# EAGLE design test2.3schematic (EAGLE 9.6.2)
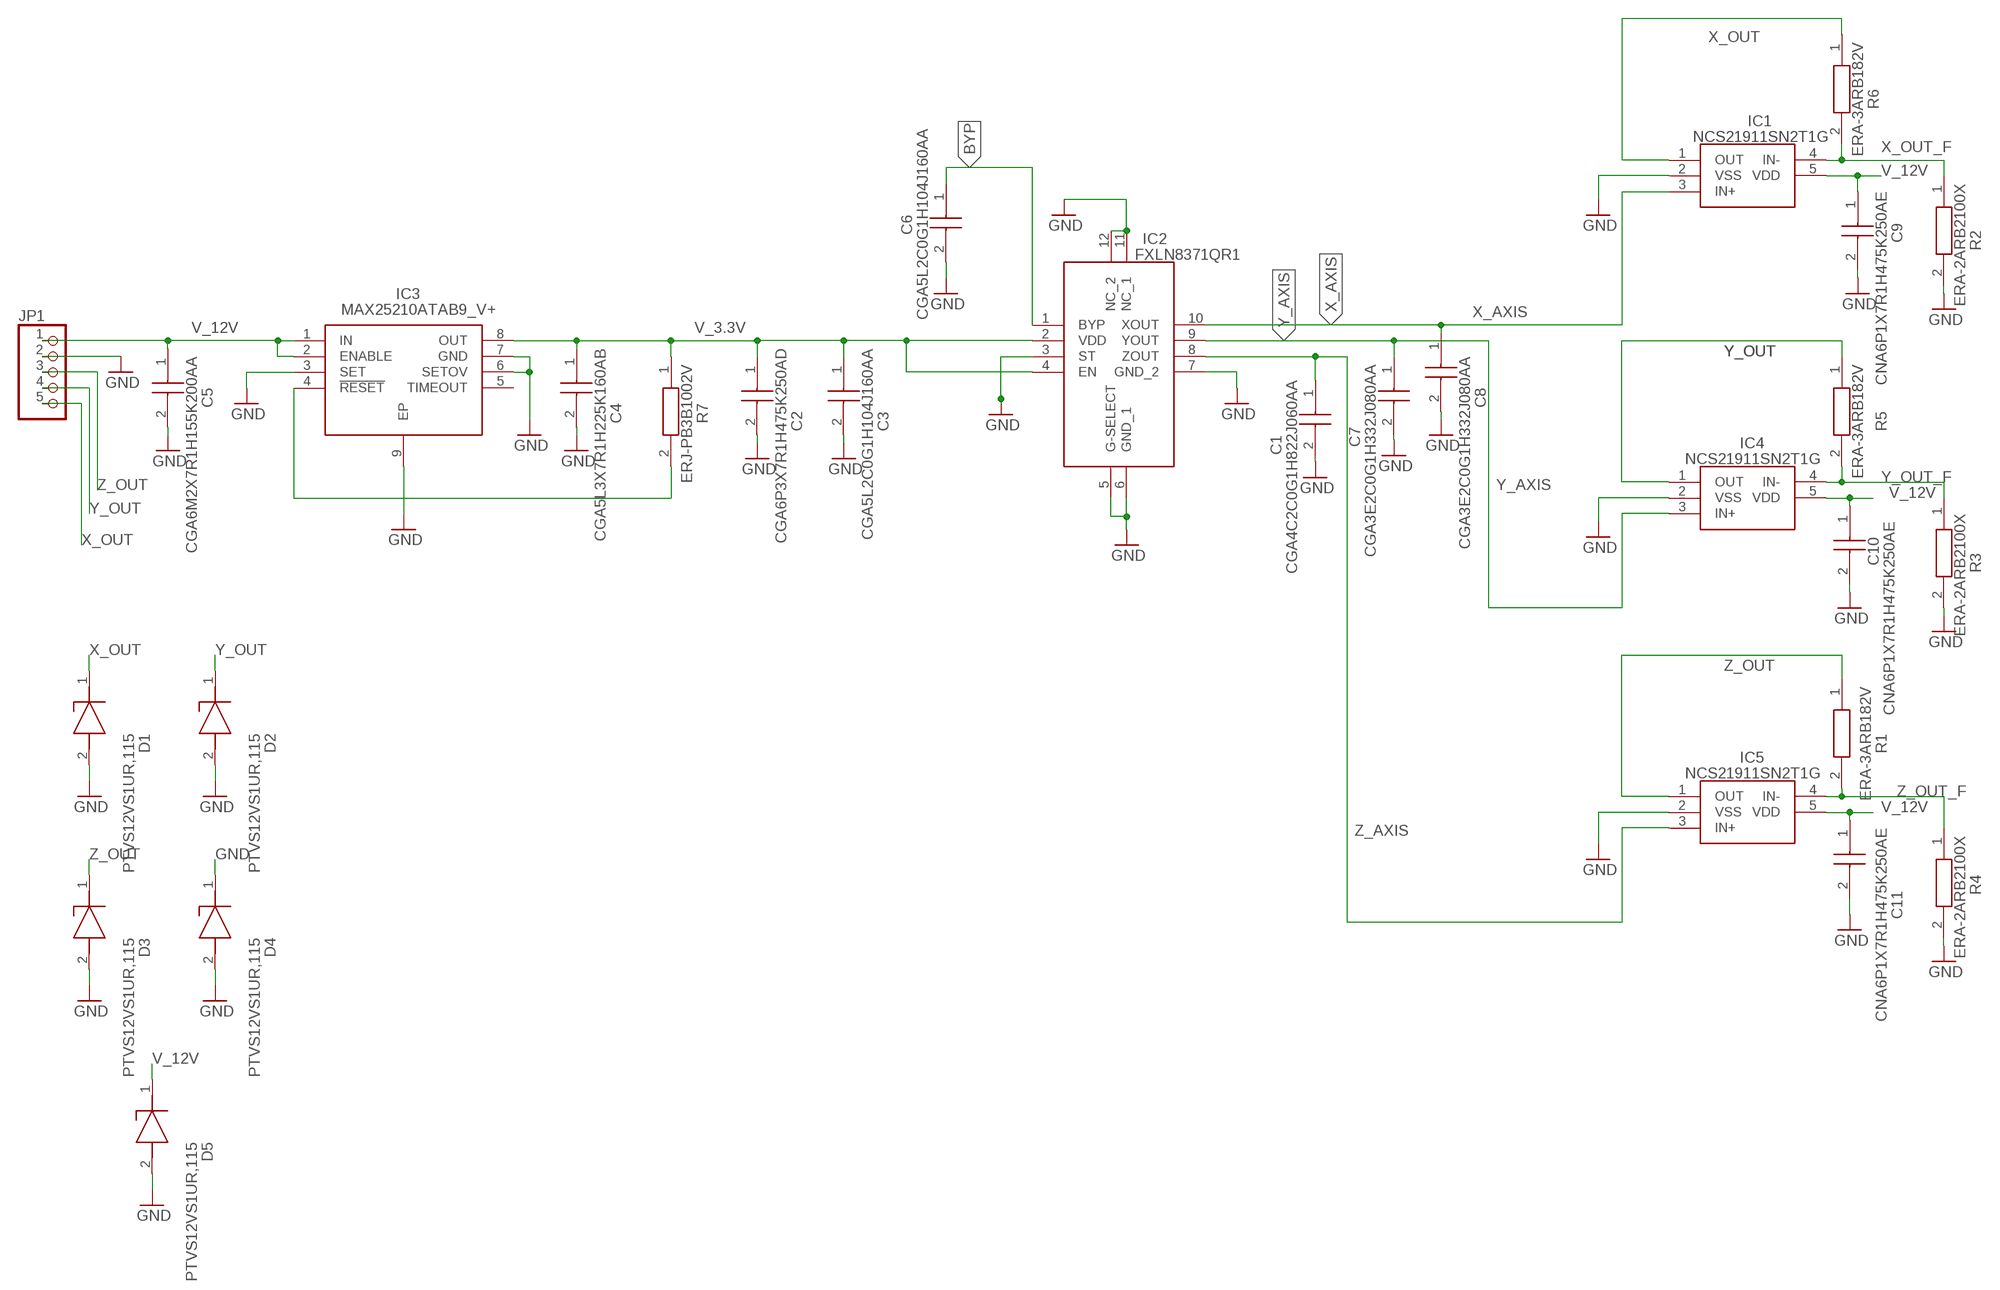
[diagram p0: schematic, sheet 1]

## Parts
C1  CGA4C2C0G1H822J060AA  [CAPC2012X145N]
C2  CGA6P3X7R1H475K250AD  [CAPC3225X280N]
C3  CGA5L2C0G1H104J160AA  [CAPC3216X180N]
C4  CGA5L3X7R1H225K160AB  [CAPC3317X190N]
C5  CGA6M2X7R1H155K200AA  [CAPC3225X220N]
C6  CGA5L2C0G1H104J160AA  [CAPC3216X180N]
C7  CGA3E2C0G1H332J080AA  [CAPC1608X90N]
C8  CGA3E2C0G1H332J080AA  [CAPC1608X90N]
C9  CNA6P1X7R1H475K250AE  [CAPC3225X280N]
C10  CNA6P1X7R1H475K250AE  [CAPC3225X280N]
C11  CNA6P1X7R1H475K250AE  [CAPC3225X280N]
D1  PTVS12VS1UR,115  [SOD123W]
D2  PTVS12VS1UR,115  [SOD123W]
D3  PTVS12VS1UR,115  [SOD123W]
D4  PTVS12VS1UR,115  [SOD123W]
D5  PTVS12VS1UR,115  [SOD123W]
IC1  NCS21911SN2T1G  [SOT95P275X110-5N]
IC2  FXLN8371QR1  [QFN65P300X300X100-12N]
IC3  MAX25210ATAB9_V+  [SON65P300X300X80-9N]
IC4  NCS21911SN2T1G  [SOT95P275X110-5N]
IC5  NCS21911SN2T1G  [SOT95P275X110-5N]
JP1  PINHD-1X5  [1X05]
R1  ERA-3ARB182V  [ERA3A_(0603)]
R2  ERA-2ARB2100X  [RESC1005X40N]
R3  ERA-2ARB2100X  [RESC1005X40N]
R4  ERA-2ARB2100X  [RESC1005X40N]
R5  ERA-3ARB182V  [ERA3A_(0603)]
R6  ERA-3ARB182V  [ERA3A_(0603)]
R7  ERJ-PB3B1002V  [RESC1608X55N]

## Nets
BYP: C6.1 IC2.1(BYP)
GND: C1.2 C2.2 C3.2 C4.2 C5.2 C6.2 C7.2 C8.2 C9.2 C10.2 C11.2 D1.2(A) D2.2(A) D3.2(A) D4.1(K) D4.2(A) D5.2(A) IC1.2(VSS) IC2.3(ST) IC2.5(G-SELECT) IC2.6(GND_1) IC2.7(GND_2) IC2.11(NC_1) IC2.12(NC_2) IC3.3(SET) IC3.6(SETOV) IC3.7(GND) IC3.9(EP) IC4.2(VSS) IC5.2(VSS) JP1.2 R2.2 R3.2 R4.2
V_3.3V: C2.1 C3.1 C4.1 IC2.2(VDD) IC2.4(EN) IC3.8(OUT) R7.1
V_12V: C5.1 C9.1 C10.1 C11.1 D5.1(K) IC1.5(VDD) IC3.1(IN) IC3.2(ENABLE) IC4.5(VDD) IC5.5(VDD) JP1.1
V_RESET: IC3.4(!RESET) R7.2
X_AXIS: C8.1 IC1.3(IN+) IC2.10(XOUT)
X_OUT: D1.1(K) IC1.1(OUT) JP1.5 R6.1
X_OUT_F: IC1.4(IN-) R2.1 R6.2
Y_AXIS: C7.1 IC2.9(YOUT) IC4.3(IN+)
Y_OUT: D2.1(K) IC4.1(OUT) JP1.4 R5.1
Y_OUT_F: IC4.4(IN-) R3.1 R5.2
Z_AXIS: C1.1 IC2.8(ZOUT) IC5.3(IN+)
Z_OUT: D3.1(K) IC5.1(OUT) JP1.3 R1.1
Z_OUT_F: IC5.4(IN-) R1.2 R4.1
Unconnected: IC3.5(TIMEOUT)

## Library data of the parts
C1 = SamacSys_Parts:CGA4C2C0G1H822J060AA: TDK - CGA4C2C0G1H822J060AA - CAP, MLCC, C0G/NP0, 8200PF, 50V, 0805 Source: Datasheet <https://componentsearchengine.com/Datasheets/1/CGA4C2C0G1H822J060AA.pdf>
C2 = SamacSys_Parts:CGA6P3X7R1H475K250AD: Multilayer Ceramic Capacitors MLCC - SMD/SMT EPXY 1210, AEC-Q200, X7R, 50V Source: Datasheet <https://product.tdk.com/en/system/files?file=dam/doc/product/capacitor/ceramic/mlcc/catalog/mlcc_automotive_epoxy_en.pdf>
C3 C6 = SamacSys_Parts:CGA5L2C0G1H104J160AA: TDK - CGA5L2C0G1H104J160AA - CAP, MLCC, C0G/NP0, 100NF, 50V, 1206 Source: Datasheet <https://datasheet.datasheetarchive.com/originals/distributors/Datasheets-DGA20/25667.pdf>
C4 = SamacSys_Parts:CGA5L3X7R1H225K160AB: MLCC CGA 1206 X7R 2.2uF 50V Automotive TDK 3216 CGA 2.2uF Ceramic Multilayer Capacitor, 50 V dc, +125C, X7R Dielectric, +/-10% Source: Datasheet <https://componentsearchengine.com/Datasheets/1/CGA5L3X7R1H225K160AB.pdf>
C5 = SamacSys_Parts:CGA6M2X7R1H155K200AA: TDK 1.5uF Multilayer Ceramic Capacitor MLCC 50 V dc +/-10% X7R Dielectric 3225 Solder Max. Op. Temp. +125C Source: Datasheet <https://product.tdk.com/en/search/capacitor/ceramic/mlcc/info?part_no=CGA6M2X7R1H155K200AA>; DESCRIPTION: TDK 1.5uF Multilayer Ceramic Capacitor MLCC 50 V dc +/-10% X7R Dielectric 3225 Solder Max. Op. Temp. +125C; HEIGHT: 2.2mm; MANUFACTURER_NAME: TDK; MANUFACTURER_PART_NUMBER: CGA6M2X7R1H155K200AA
C7 C8 = SamacSys_Parts:CGA3E2C0G1H332J080AA: Capacitor Auto CGA 0603 50V 3.3nF C0G Source: Datasheet <https://componentsearchengine.com/Datasheets/1/CGA3E2C0G1H332J080AA.pdf>
C9-C11 = SamacSys_Parts:CNA6P1X7R1H475K250AE: Multilayer Ceramic Chip Capacitors, Capacitance=4.7uF, LxWxT:3.2x2.5x2.5mm Source: Datasheet <https://product.tdk.com/system/files/dam/doc/product/capacitor/ceramic/mlcc/catalog/mlcc_automotive_soft_cna_en.pdf>; DESCRIPTION: Multilayer Ceramic Chip Capacitors, Capacitance=4.7uF, LxWxT:3.2x2.5x2.5mm; HEIGHT: 2.8mm; MANUFACTURER_NAME: TDK; MANUFACTURER_PART_NUMBER: CNA6P1X7R1H475K250AE; MOUSER_PART_NUMBER: 810-CNA6P1X7R1H475K2; MOUSER_PRICE-STOCK: https://www.mouser.co.uk/ProductDetail/TDK/CNA6P1X7R1H475K250AE?qs=w%2Fv1CP2dgqp5TAwoFLGJ7g%3D%3D
D1-D5 = SamacSys_Parts:PTVS12VS1UR,115: PTVSxS1UR series - 400 W Transient Voltage Suppressor Source: Datasheet <https://assets.nexperia.com/documents/data-sheet/PTVSXS1UR_SER.pdf>; ARROW_PART_NUMBER: PTVS12VS1UR,115; ARROW_PRICE-STOCK: https://www.arrow.com/en/products/ptvs12vs1ur115/nexperia?region=nac; DESCRIPTION: PTVSxS1UR series - 400 W Transient Voltage Suppressor; HEIGHT: mm; MANUFACTURER_NAME: Nexperia; MANUFACTURER_PART_NUMBER: PTVS12VS1UR,115; MOUSER_PART_NUMBER: 771-PTVS12VS1UR115; MOUSER_PRICE-STOCK: https://www.mouser.co.uk/ProductDetail/Nexperia/PTVS12VS1UR115?qs=LMSg3oBIm%2FiWSHvsyxWiLg%3D%3D
IC1 IC4 IC5 = SamacSys_Parts:NCS21911SN2T1G: Operational Amplifiers - Op Amps 2 MHz Source: Datasheet <https://www.arrow.com/en/products/ncs21911sn2t1g/on-semiconductor>; DESCRIPTION: Operational Amplifiers - Op Amps 2 MHz; HEIGHT: 1.1mm; MANUFACTURER_NAME: ON Semiconductor; MANUFACTURER_PART_NUMBER: NCS21911SN2T1G; MOUSER_PART_NUMBER: 863-NCS21911SN2T1G; MOUSER_PRICE-STOCK: https://www.mouser.co.uk/ProductDetail/ON-Semiconductor/NCS21911SN2T1G/?qs=%252B6g0mu59x7Ix%2FTFBhvJ5Cw%3D%3D
IC2 = SamacSys_Parts:FXLN8371QR1: 3-Axis LowPower Analog-Output Accelerometer Source: Datasheet <http://www.nxp.com/docs/en/data-sheet/FXLN83xxQ.pdf>; DESCRIPTION: 3-Axis LowPower Analog-Output Accelerometer; HEIGHT: 1mm; MANUFACTURER_NAME: NXP; MANUFACTURER_PART_NUMBER: FXLN8371QR1; MOUSER_PART_NUMBER: 841-FXLN8371QR1; MOUSER_PRICE-STOCK: https://www.mouser.co.uk/ProductDetail/NXP-Semiconductors/FXLN8371QR1?qs=y0HsvvugQ4753eIkpIfw3w%3D%3D
IC3 = SamacSys_Parts:MAX25210ATAB9_V+: Linear Voltage Regulators ATO707, High Voltage LDO in P90D Source: Datasheet <https://pdfserv.maximintegrated.com/en/ds/MAX25210.pdf>; DESCRIPTION: Linear Voltage Regulators ATO707, High Voltage LDO in P90D; HEIGHT: 0.8mm; MANUFACTURER_NAME: Maxim Integrated; MANUFACTURER_PART_NUMBER: MAX25210ATAB9/V+; MOUSER_PART_NUMBER: 700-MAX25210ATAB9/V+; MOUSER_PRICE-STOCK: https://www.mouser.co.uk/ProductDetail/Maxim-Integrated/MAX25210ATAB9-V%2b?qs=W%2FMpXkg%252BdQ6hnxbux6MIyA%3D%3D
JP1 = pinhead:PINHD-1X5: PIN HEADER
R1 R5 R6 = SamacSys_Parts:ERA-3ARB182V: Thin Film Resistors - SMD 0603 1.8Kohm 0.1% 10ppm AEC-Q200 Source: Datasheet <http://industrial.panasonic.com/cdbs/www-data/pdf/RDM0000/AOA0000C307.pdf>; DESCRIPTION: Thin Film Resistors - SMD 0603 1.8Kohm 0.1% 10ppm AEC-Q200; HEIGHT: 0.5mm; MANUFACTURER_NAME: Panasonic; MANUFACTURER_PART_NUMBER: ERA-3ARB182V; MOUSER_PART_NUMBER: 667-ERA-3ARB182V; MOUSER_PRICE-STOCK: https://www.mouser.co.uk/ProductDetail/Panasonic/ERA-3ARB182V/?qs=ob%252BdNz2%252BYEjGzGWnPP7P7w%3D%3D
R2-R4 = SamacSys_Parts:ERA-2ARB2100X: Metal Thin Film Chip Resistor, 0402, 0.063W Source: Datasheet <https://componentsearchengine.com/Datasheets/1/ERA-2ARB2100X.pdf>
R7 = SamacSys_Parts:ERJ-PB3B1002V: Thick Film Resistors - SMD 0603 Anti-Surge Res. 0.1%, 10Kohm Source: Datasheet <https://componentsearchengine.com/Datasheets/1/ERJ-PB3B1002V.pdf>; DESCRIPTION: Thick Film Resistors - SMD 0603 Anti-Surge Res. 0.1%, 10Kohm; HEIGHT: 0.55mm; MANUFACTURER_NAME: Panasonic; MANUFACTURER_PART_NUMBER: ERJ-PB3B1002V; MOUSER_PART_NUMBER: 667-ERJ-PB3B1002V; MOUSER_PRICE-STOCK: https://www.mouser.co.uk/ProductDetail/Panasonic/ERJ-PB3B1002V?qs=RYIBGgAklzLBKZE0dH9NHQ%3D%3D

## Net classes
0 default: width 0.254 mm, drill 0.254 mm, clearance 0.254 mm

## Board
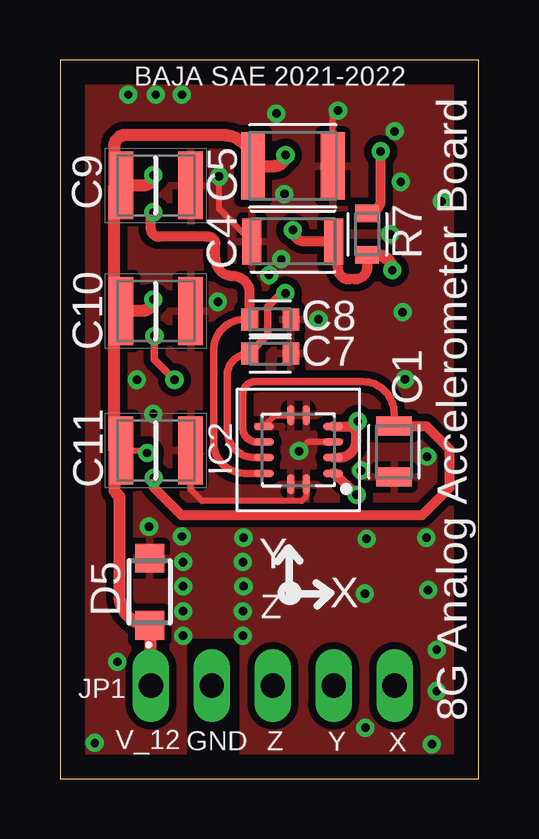
[diagram p1: board, top side]
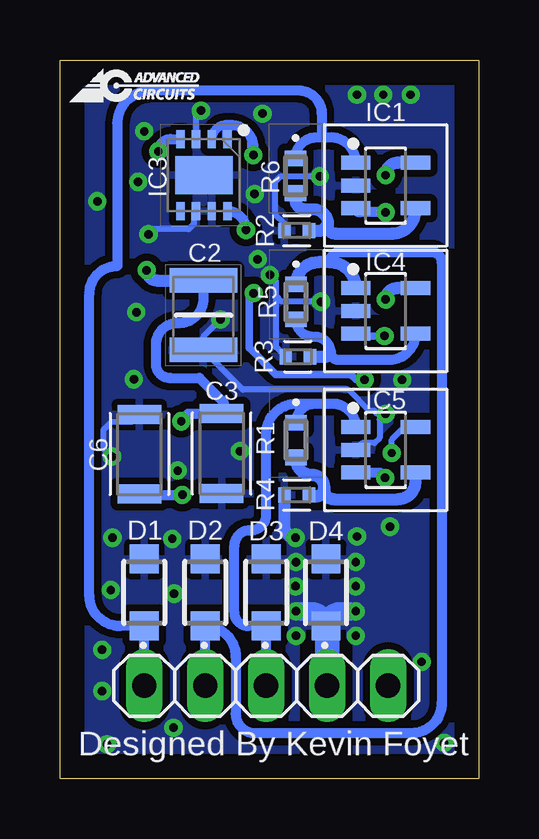
[diagram p2: board, bottom side, seen from below]

Size 17.46 x 29.97 mm. Coordinates in mm from the lower left corner, seen from the top.
Outline: 0,0 17.45,0 17.45,29.97 0,29.97 0,0
Copper layers (1*16): Top 0.035mm / dielectric 1.5mm / Bottom 0.035mm
Design rules "default *": minimum track width 6mil, minimum drill 0.35mm, track to track 6mil, track to pad 6mil, pad to pad 6mil, via to via 6mil, smd to smd 6mil, copper to edge 40mil, drill to drill 6mil, minimum pad ring 10mil, minimum via ring 8mil, stop-mask expansion 4mil, vias tented up to drill 21mil, thermal gap 10mil

### Footprints (pad centres in the part's own frame; a part is rotated, then mirrored left to right if it is on the bottom)
CAPC2012X145N = smd 0.792 x 1.465: 1 -1.062,0; 2 1.062,0
CAPC3225X280N = smd 1.02 x 2.82: 1 -1.45,0; 2 1.45,0
CAPC3216X180N = smd 0.792 x 1.815: 1 -1.662,0; 2 1.662,0
CAPC3317X190N = smd 0.792 x 1.915: 1 -1.712,0; 2 1.712,0
CAPC3225X220N = smd 0.984 x 2.81: 1 -1.662,0; 2 1.662,0
CAPC1608X90N = smd 0.706 x 0.929: 1 -0.861,0; 2 0.861,0
SOD123W = smd 1.2 x 1.2: 1 -1.4,0; 2 1.4,0
SOT95P275X110-5N = smd 1.224 x 0.584: 1 -1.244,0.95; 2 -1.244,0; 3 -1.244,-0.95; 4 1.244,-0.95; 5 1.244,0.95
QFN65P300X300X100-12N = smd 0.837 x 0.32: 1 -1.437,0.975; 2 -1.437,0.325; 3 -1.437,-0.325; 4 -1.437,-0.975; 7 1.437,-0.975; 8 1.437,-0.325; 9 1.437,0.325; 10 1.437,0.975 | smd 0.32 x 0.837: 5 -0.325,-1.437; 6 0.325,-1.437; 11 0.325,1.437; 12 -0.325,1.437
SON65P300X300X80-9N = smd 0.75 x 0.35: 1 -1.5,0.975; 2 -1.5,0.325; 3 -1.5,-0.325; 4 -1.5,-0.975; 5 1.5,-0.975; 6 1.5,-0.325; 7 1.5,0.325; 8 1.5,0.975 | smd 1.6 x 2.4: 9 0,0
1X05 = drill 1.016 long: 1 -5.08,0; 2 -2.54,0; 3 0,0; 4 2.54,0; 5 5.08,0
ERA3A_(0603) = smd 0.65 x 0.9: 1 -0.725,0; 2 0.725,0
RESC1005X40N = smd 0.51 x 0.637: 1 -0.51,0; 2 0.51,0
RESC1608X55N = smd 0.733 x 0.979: 1 -0.869,0; 2 0.869,0

### Placement (x,y rotation side)
C1  13.92,13.64 270 top
C2  11.48,19.33 270 bottom
C3  10.72,13.56 270 bottom
C4  9.7,22.4 180 top
C5  9.7,25.55 0 top
C6  14.15,13.54 90 bottom
C7  8.76,17.73 0 top
C8  8.76,19.15 0 top
C9  3.99,24.74 0 top
C10  3.99,19.51 0 top
C11  3.99,13.69 0 top
D1  13.94,7.77 90 bottom
D2  11.4,7.77 90 bottom
D3  8.86,7.77 90 bottom
D4  6.38,7.77 90 bottom
D5  3.73,7.8 90 top
IC1  3.89,24.74 0 bottom
IC2  9.93,13.72 180 top
IC3  11.46,25.17 270 bottom
IC4  3.89,19.51 0 bottom
IC5  3.89,13.72 0 bottom
JP1  8.86,3.89 180 bottom
R1  7.62,14.12 270 bottom
R2  7.59,22.86 180 bottom
R3  7.54,17.6 180 bottom
R4  7.59,11.84 180 bottom
R5  7.62,19.89 270 bottom
R6  7.65,25.15 270 bottom
R7  12.8,22.71 90 top

### Tracks (layer width: path | path; a pad name or v marks a point on that pad's centre or on a via)
BYP  (via drill 0.35)
  Top 0.406: v12.36,11.84 11.46,12.74 IC2.1
  Bottom 0.406: C6.1 14.11,11.84 v12.36,11.84
GND  (via drill 0.35)
  Top 0.254: IC2.6 8.96,15.15 IC2.7 | C4.2 6.63,23.76 v6.63,25.12 | IC2.3 10.33,14.04 v9.96,13.66 | C5.2 11.37,27.65 v11.58,27.86 | IC2.12 10.26,11.78 10.06,11.58 5.92,11.58 5.44,12.06 C11.2
  Bottom 0.254: 8.45,20.13 8.23,19.91 6.6,19.91 v6.58,19.89 | 8.45,20.13 8.45,20.75 v8.71,21.01 | R2.2 8.1,23.16 8.48,23.53 8.48,24.9 8.25,25.13 7.04,25.13 7.03,25.12 v6.63,25.12 | R3.2 8.45,18 8.45,20.13 | v10.77,19.15 11.48,18.44 C2.2 9.83,16.23 5.45,16.23 4.56,15.34 4.36,15.34 4.24,15.21 v3.89,15.21 4.14,14.96 4.14,14.22 4.36,13.99 4.85,13.99 IC5.2 | IC3.6 11.87,23.58 11.87,23.14 12.1,22.91 13.56,22.91 v13.77,22.71 | IC3.3 11.78,27.67 v11.58,27.86 | C6.2 14.46,14.88 15.32,14.88 15.65,14.55 15.65,13.77 15.32,13.44 v15.29,13.44
  Bottom 0.508: R4.2 8.1,10.52 arc-90 v7.65,10.06
  Bottom 0.762: v7.62,6.98 6.99,6.98 arc90 D4.1 arc90 5.76,6.98 v5.13,6.98
  Bottom 1.016: JP1.2 6.33,6.32 D4.1
  other vias: 1.45,1.5 15.49,1.45 15.7,3.66 14.38,16.66 14.27,19.46 2.39,4.88 5.13,5.97 7.62,5.97 12.78,10.01 12.7,7.72 3.2,16.64 9.22,21.67 9.35,24.38 2.84,28.52 3.99,28.52 5.08,28.52 15.9,24.08 13.94,27 14.2,24.89 12.73,2.13 12.55,12.85 9.02,27.74 3.71,10.52 5.08,10.11 5.13,9.04 5.13,8.03 7.62,9.04 7.65,8.03 15.27,10.06 15.34,7.87 15.7,5.38
  pour Top (isolate 0.305): 0,29.97 17.45,29.97 17.45,0 7.65,0 7.65,5.99 5.13,5.99 5.13,0 0,0
  pour Bottom (isolate 0.305): 0,29.97 17.45,29.97 17.45,0 7.62,0 7.62,5.99 5.11,5.99 5.11,0 0,0
V_3.3V  (via drill 0.35)
  Top 0.381: IC2.2 11.61,13.39
  Top 0.406: v9.7,22.89 arc90 10.19,22.4 C4.1 arc-90 11.58,22.23 11.58,21.29 arc90 12.04,20.83 12.29,20.83 arc90 12.8,21.34 R7.1 | 11.61,13.39 arc90 12.34,14.12 12.34,14.35 | IC2.4 12,14.69 arc-90 12.34,14.35 | 12.34,14.35 12.34,14.85 arc-90 v12.41,14.91
  Top 0.508: R7.1 13.21,21.84 arc-90 v13.84,21.21
  Bottom 0.406: v9.7,22.89 9.7,22.89 arc-90 IC3.8 | C2.1 11.48,20.02 arc90 12.5,19 12.57,19 arc-90 13.46,18.11 13.46,17.3 arc-90 12.88,16.71 11.65,16.71 10.72,15.78 arc90 C3.1 12.12,15.23 12.12,15.19 v12.41,14.91
  Bottom 0.508: v13.84,21.21 arc-90 13.41,20.78 C2.1
V_12V  (via drill 0.35)
  Top 0.254: C11.1 3.53,13.69 v3.63,13.59
  Top 0.508: 2.26,13.72 2.26,12.01 2.38,11.88 2.48,11.76 2.48,7.65 arc90 D5.1 arc-90 3.79,6.35 JP1.1 | 2.26,13.72 2.26,19.56 | 2.26,19.56 2.26,24.74 | 2.26,24.74 2.26,26.37 arc-90 2.74,26.85 6.77,26.85 arc-90 8.04,25.58 C5.1 8.94,25.55 arc90 v9.4,26.01 | C11.1 2.29,13.69 arc-90 2.26,13.72 | v3.89,19.99 arc-90 3.4,19.51 C10.1 2.31,19.51 arc-90 2.26,19.56 | v3.89,25.17 arc-90 3.45,24.74 C9.1 2.26,24.74
  Bottom 0.254: v3.63,13.59 3.63,14.15 3.11,14.67 IC5.5
  Bottom 0.381: 10.55,27.25 arc-90 IC3.2
  Bottom 0.406: v9.4,26.01 9.4,26.34 arc-90 10.31,27.25 | 10.31,27.25 10.55,27.25 | IC3.1 10.48,27.09 arc90 10.31,27.25
  Bottom 0.508: IC4.5 3.42,20.46 arc-90 v3.89,19.99 | IC1.5 3.37,25.69 arc-90 v3.89,25.17
V_RESET  (via drill 0.35)
  Top 0.406: R7.2 arc90 13.36,24.13 v13.36,26.16
  Bottom 0.406: v13.36,26.16 arc90 12.85,26.67 IC3.4
X_AXIS  (via drill 0.35)
  Top 0.305: IC2.10 7.67,12.74 arc-90 6.4,14.01 6.4,17.88 arc-90 7.67,19.15 C8.1
  Top 0.406: C8.1 7.9,20.27 arc90 7.21,20.95 arc-90 6.48,21.69 6.48,22.3 arc90 6.17,22.61 4.12,22.61 arc-90 3.79,22.94 3.79,23.52 arc-90 v3.89,23.62
  Bottom 0.406: v3.89,23.62 4.96,23.62 arc90 IC1.3
X_OUT
  Bottom 0.406: R6.1 arc90 6.77,26.75 6.55,26.75 | IC1.1 arc-90 6.19,26.75 6.55,26.75 | 6.55,26.75 6.55,27.74 arc-90 7.52,28.7 13.67,28.7 arc-90 15.06,27.3 15.06,21.39 arc-90 16.23,20.22 16.23,7.64 arc-90 14.96,6.37 D1.1 JP1.5
X_OUT_F
  Bottom 0.508: R6.2 7.65,24.14 arc-90 7.25,23.75 6.91,23.75 arc90 6.29,23.13 6.34,23.08 | IC1.4 2.64,23.72 arc90 3.63,22.73 5.97,22.73 arc90 6.33,23.09 arc90 6.34,23.08 | R2.1 6.55,22.86 6.34,23.08
Y_AXIS  (via drill 0.35)
  Top 0.305: IC2.9 8.12,13.39 arc-90 6.96,14.55 6.96,16.79 arc-90 C7.1 7.9,17.76 8.66,18.52 8.66,19.68 9.23,20.25 v9.39,20.25 | v3.94,18.47 3.94,17.47 v4.77,16.64
  Bottom 0.305: IC4.3 5.04,18.47 v3.94,18.47 | v4.77,16.64 5.11,16.64 5.33,16.87 8.46,16.87 9.56,17.96 9.58,17.96 9.58,20.06 v9.39,20.25
Y_OUT
  Bottom 0.406: 6.21,21.54 arc90 5.78,21.97 1.98,21.97 arc90 1.55,21.54 1.55,3.18 arc90 2.82,1.9 9.32,1.9 arc90 10.14,2.72 10.14,5.1 arc-90 D2.1 JP1.4
  Bottom 0.508: IC4.1 arc-90 6.21,21.54 6.69,21.54 arc-90 R5.1
Y_OUT_F
  Bottom 0.406: 7.62,19.13 arc-90 6.93,18.44 6.83,18.44 arc90 6.2,17.8 arc-90 5.87,17.48 3.72,17.48 arc-90 IC4.4
  Bottom 0.508: R5.2 7.62,19.13 | R3.1 6.4,17.6 arc-90 6.2,17.8
Z_AXIS  (via drill 0.35)
  Top 0.305: IC2.8 8.21,14.04 arc-90 7.62,14.63 7.62,16.05 arc-90 8.13,16.56 12.62,16.56 arc-90 13.92,15.26 C1.1
  Top 0.406: v3.91,12.55 3.91,12.14 5.06,11 15.09,11 16.23,12.14 16.23,13.74 15.27,14.7 C1.1
  Bottom 0.406: IC5.3 4.13,12.77 v3.91,12.55
Z_OUT
  Bottom 0.406: IC5.1 arc-90 6.11,15.65 6.82,15.65 | R1.1 arc90 6.82,15.65 | 6.82,15.65 7.6,15.65 arc-90 8.87,14.38 8.87,11 arc90 9.5,10.36 9.55,10.36 arc-90 10.19,9.73 10.19,6.93 arc-90 9.62,6.37 D3.1 JP1.3
Z_OUT_F
  Bottom 0.508: R1.2 7.62,13.34 arc-90 6.96,12.68 arc95 6.45,12.12 | IC5.4 2.64,12.39 arc90 3.38,11.66 6.05,11.66 arc94 6.45,12.12 | 6.45,12.12 arc121 R4.1

### Text on the board
tPlace: C:/Users/forre/Downloads/adv.bmp
tNames: BAJA SAE 2021-2022 | 8G Analog Accelerometer Board | Y | Z | X | V_12 | GND | Z | Y | X
bNames: Designed By Kevin Foyet